# Altium schematic sheet FM25Q64AI3-SOB-T-G1_FM25Q64AI3-SOB-T-G.schdoc
size 127 x 99 mm
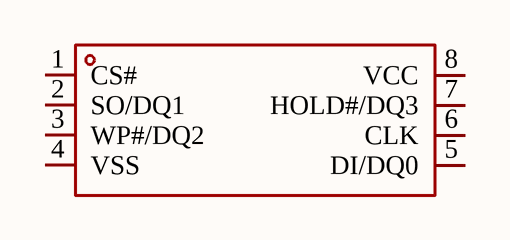
[diagram p0: FM25Q64AI3-SOB-T-G1_FM25Q64AI3-SOB-T-G.schdoc]

## Parts
U?  FM25Q64AI3-SOB-T-G  [SOIC-8_L5.3-W5.3-P1.27-LS8.0-BL]  (value not drawn)

## Nets

Not connected (* = marked no-connect by the designer): U? 1(CS#) 2(SO/DQ1) 3(WP#/DQ2) 4(VSS) 5(DI/DQ0) 6(CLK) 7(HOLD#/DQ3) 8(VCC)

## Library data of the parts
U? = FM25Q64AI3-SOB-T-G: Manufacturer: FM(复旦微); Add into BOM: yes; Interface: SPI; Memory Size: 64Mbit; Clock Frequency: 104MHz; Voltage - Supply: 2.7V~3.6V; Program / Erase Cycles: 100000次; Page Programming Time (Tpp): 400us; Data Retention - TDR (Year): 20年; Symbol: FM25Q64AI3-SOB-T-G; Device: FM25Q64AI3-SOB-T-G; LCSC Part Name: SPI NOR Flash; Supplier Part: C19626526; Manufacturer Part: FM25Q64AI3-SOB-T-G; Supplier Footprint: SOP-8-208mil; JLCPCB Part Class: Extended Part; Datasheet: https://item.szlcsc.com/datasheet/FM25Q64AI3-SOB-T-G/20915189.html; Supplier: LCSC; Convert to PCB: yes; Block Erase Time(tBE): -; Operating Temperature: -40℃~+85℃